# Altium schematic sheet Sheet1.schdoc
size 148 x 93 mm
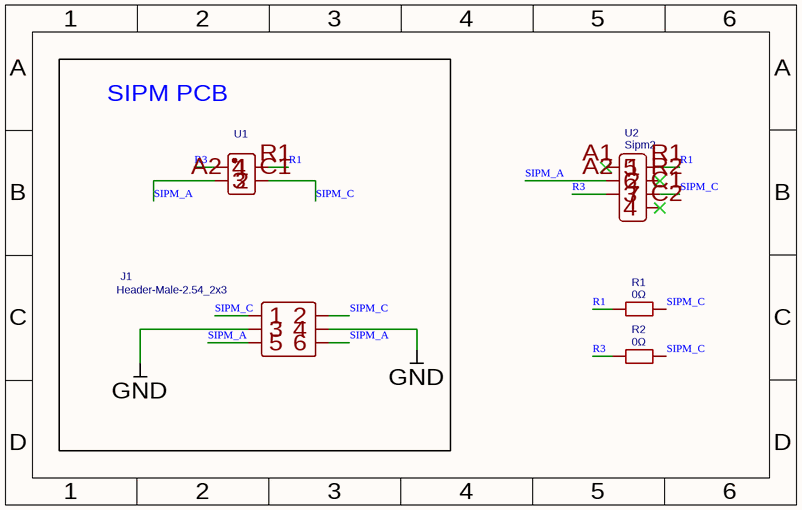
[diagram p0: Sheet1.schdoc]

## Parts
J1  Header-Male-2.54_2x3  [HDR-TH_6P-P2.54-V-M-R2-C3-S2.54-1]
R1  0Ω  [R0805]
R2  0Ω  [R0805]
U1  NO  [SIPM_ORI]  (value not drawn)
U2  Sipm2  [SIPM_REVERSE]

## Blocks framed on the sheet
SIPM PCB: J1 U1

## Nets
GND: J1.3 J1.4
R1: R1.1 U1.R1(4) U2.R1(5)
R3: R2.1 U1.?1(1) U2.?1(7)
SIPM_A: J1.5 J1.6 U1.A2(2) U2.A2(2)
SIPM_C: J1.1 J1.2 R1.2 R2.2 U1.C1(3) U2.C1(3)

Not connected (* = marked no-connect by the designer): U2 A1(1)* C2(4)* R2(6)*

## Library data of the parts
J1 = Header-Male-2.54_2x3: Manufacturer: BOOMELE(博穆精密); Manufacturer Part: 2.54-2*3P针; Supplier: LCSC; Supplier Part: C65114; JLCPCB Part Class: Extended Part; spicePre: J; spiceSymbolName: Header-Male-2.54_2x3
R1 R2 = 0Ω: Manufacturer: FOJAN(富捷); Manufacturer Part: FRC0805P000 TS; Contributor: lcsc; nameAlias: Value; Supplier: LCSC; Supplier Part: C2907288; JLCPCB Part Class: Extended Part; spicePre: R; spiceSymbolName: FRC0805P000 TS
U2 = Sipm2: Contributor: bala08052005; spicePre: U; spiceSymbolName: Sipm2
U1 = NO: spicePre: X